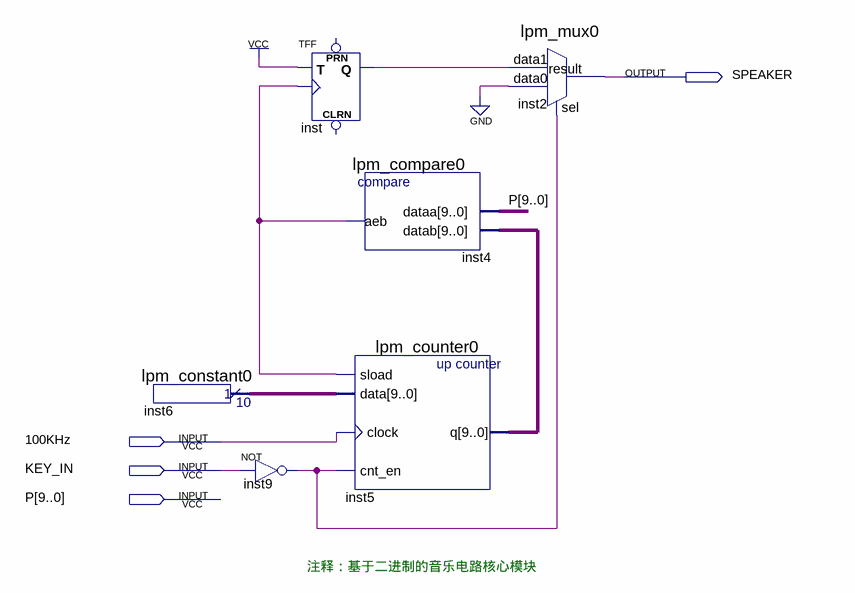
[diagram p0: schematic sheet]
// Quartus schematic MUSIC_CORE.bdf as structural Verilog: 6 symbols, 4 pins
module MUSIC_CORE (
  input  \100KHz ,
  input  KEY_IN,
  input  [9:0] P,
  output SPEAKER
);

  wire inst4_aeb, inst9_out, inst_q;
  wire [9:0] inst5_q, inst6_result;

  lpm_constant0 inst6 (.result(inst6_result));
  not inst9 (inst9_out, KEY_IN);
  TFF inst (.T(1'b1), .CLK(inst4_aeb), .Q(inst_q));  // open: PRN, CLRN
  lpm_compare0 inst4 (.dataa(P), .datab(inst5_q), .aeb(inst4_aeb));
  lpm_counter0 inst5 (.sload(inst4_aeb), .data(inst6_result), .clock(\100KHz ), .cnt_en(inst9_out), .q(inst5_q));
  lpm_mux0 inst2 (.data1(inst_q), .data0(1'b0), .sel(inst9_out), .result(SPEAKER));

  // Notes on the sheet:
  //   注释：基于二进制的音乐电路核心模块
endmodule
